# EAGLE design rain-drop-voltage-divider-v1.1 (EAGLE 9.6.2)
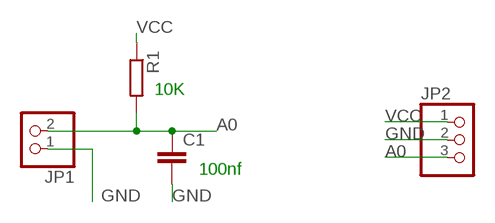
[diagram p0: schematic, sheet 1]

## Parts
C1  C2.5/2  [C2.5-2]
JP1  PINHD-1X2  [1X02]
JP2  PINHD-1X3  [1X03]
R1  R-EU_0204/7  [0204/7]

## Nets
A0: C1.1 JP1.2 JP2.3 R1.2
GND: C1.2 JP1.1 JP2.2
VCC: JP2.1 R1.1

## Notes on the sheet
- 10K
- 100nf

## Library data of the parts
C1 = capacitor-wima:C: CAPACITOR naming: grid - package width
JP1 = pinhead:PINHD-1X2: PIN HEADER
JP2 = pinhead:PINHD-1X3: PIN HEADER
R1 = rcl:R-EU_: RESISTOR, European symbol; SPICEPREFIX: R

## Board
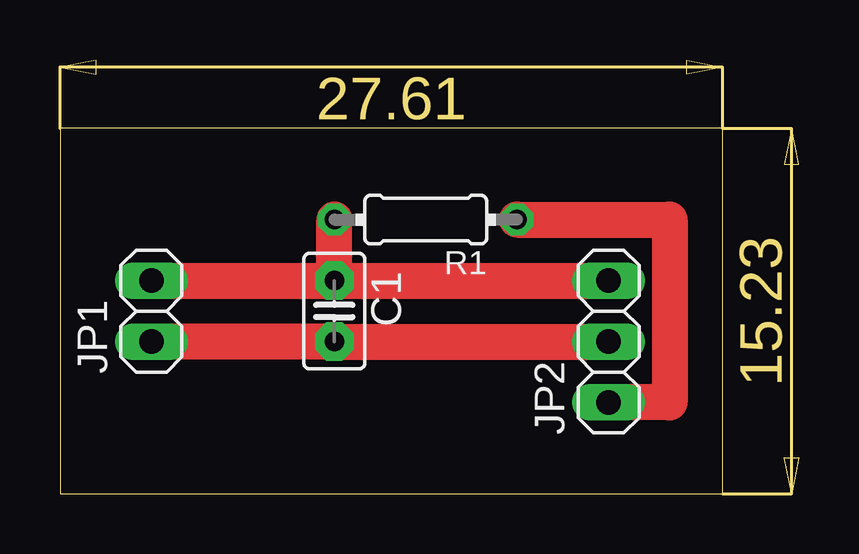
[diagram p1: board, top side]

Size 27.61 x 15.23 mm. Coordinates in mm from the lower left corner, seen from the top.
Outline: 0,0 27.61,0 27.61,15.23 0,15.23 0,0
Copper layers (1*16): Top 0.035mm / dielectric 1.5mm / Bottom 0.035mm
Design rules "default": minimum track width 6mil, minimum drill 0.35mm, track to track 6mil, track to pad 6mil, pad to pad 6mil, via to via 6mil, smd to smd 6mil, copper to edge 40mil, drill to drill 6mil, minimum pad ring 10mil, minimum via ring 8mil, stop-mask expansion 4mil, vias tented up to drill 0mil, thermal gap 10mil

### Footprints (pad centres in the part's own frame; a part is rotated, then mirrored left to right if it is on the bottom)
C2.5-2 = drill 0.813 pad 1.6 octagon: 1 -1.27,0; 2 1.27,0
1X02 = drill 1.016 long: 1 -1.27,0; 2 1.27,0
1X03 = drill 1.016 long: 1 -2.54,0; 2 0,0; 3 2.54,0
0204/7 = drill 0.813 octagon: 1 -3.81,0; 2 3.81,0

### Placement (x,y rotation side)
C1  11.43,7.62 270 top
JP1  3.81,7.62 90 top
JP2  22.86,6.35 90 top
R1  15.24,11.43 180 top

### Tracks (layer width: path | path; a pad name or v marks a point on that pad's centre or on a via)
A0
  Top 1.5: JP1.2 C1.1 | C1.1 R1.2 | C1.1 JP2.3
GND
  Top 1.5: JP2.2 C1.2 JP1.1
VCC
  Top 1.5: R1.1 25.4,11.43 25.4,3.81 JP2.1